# EAGLE design Soccer_V4 (EAGLE 9.6.2)
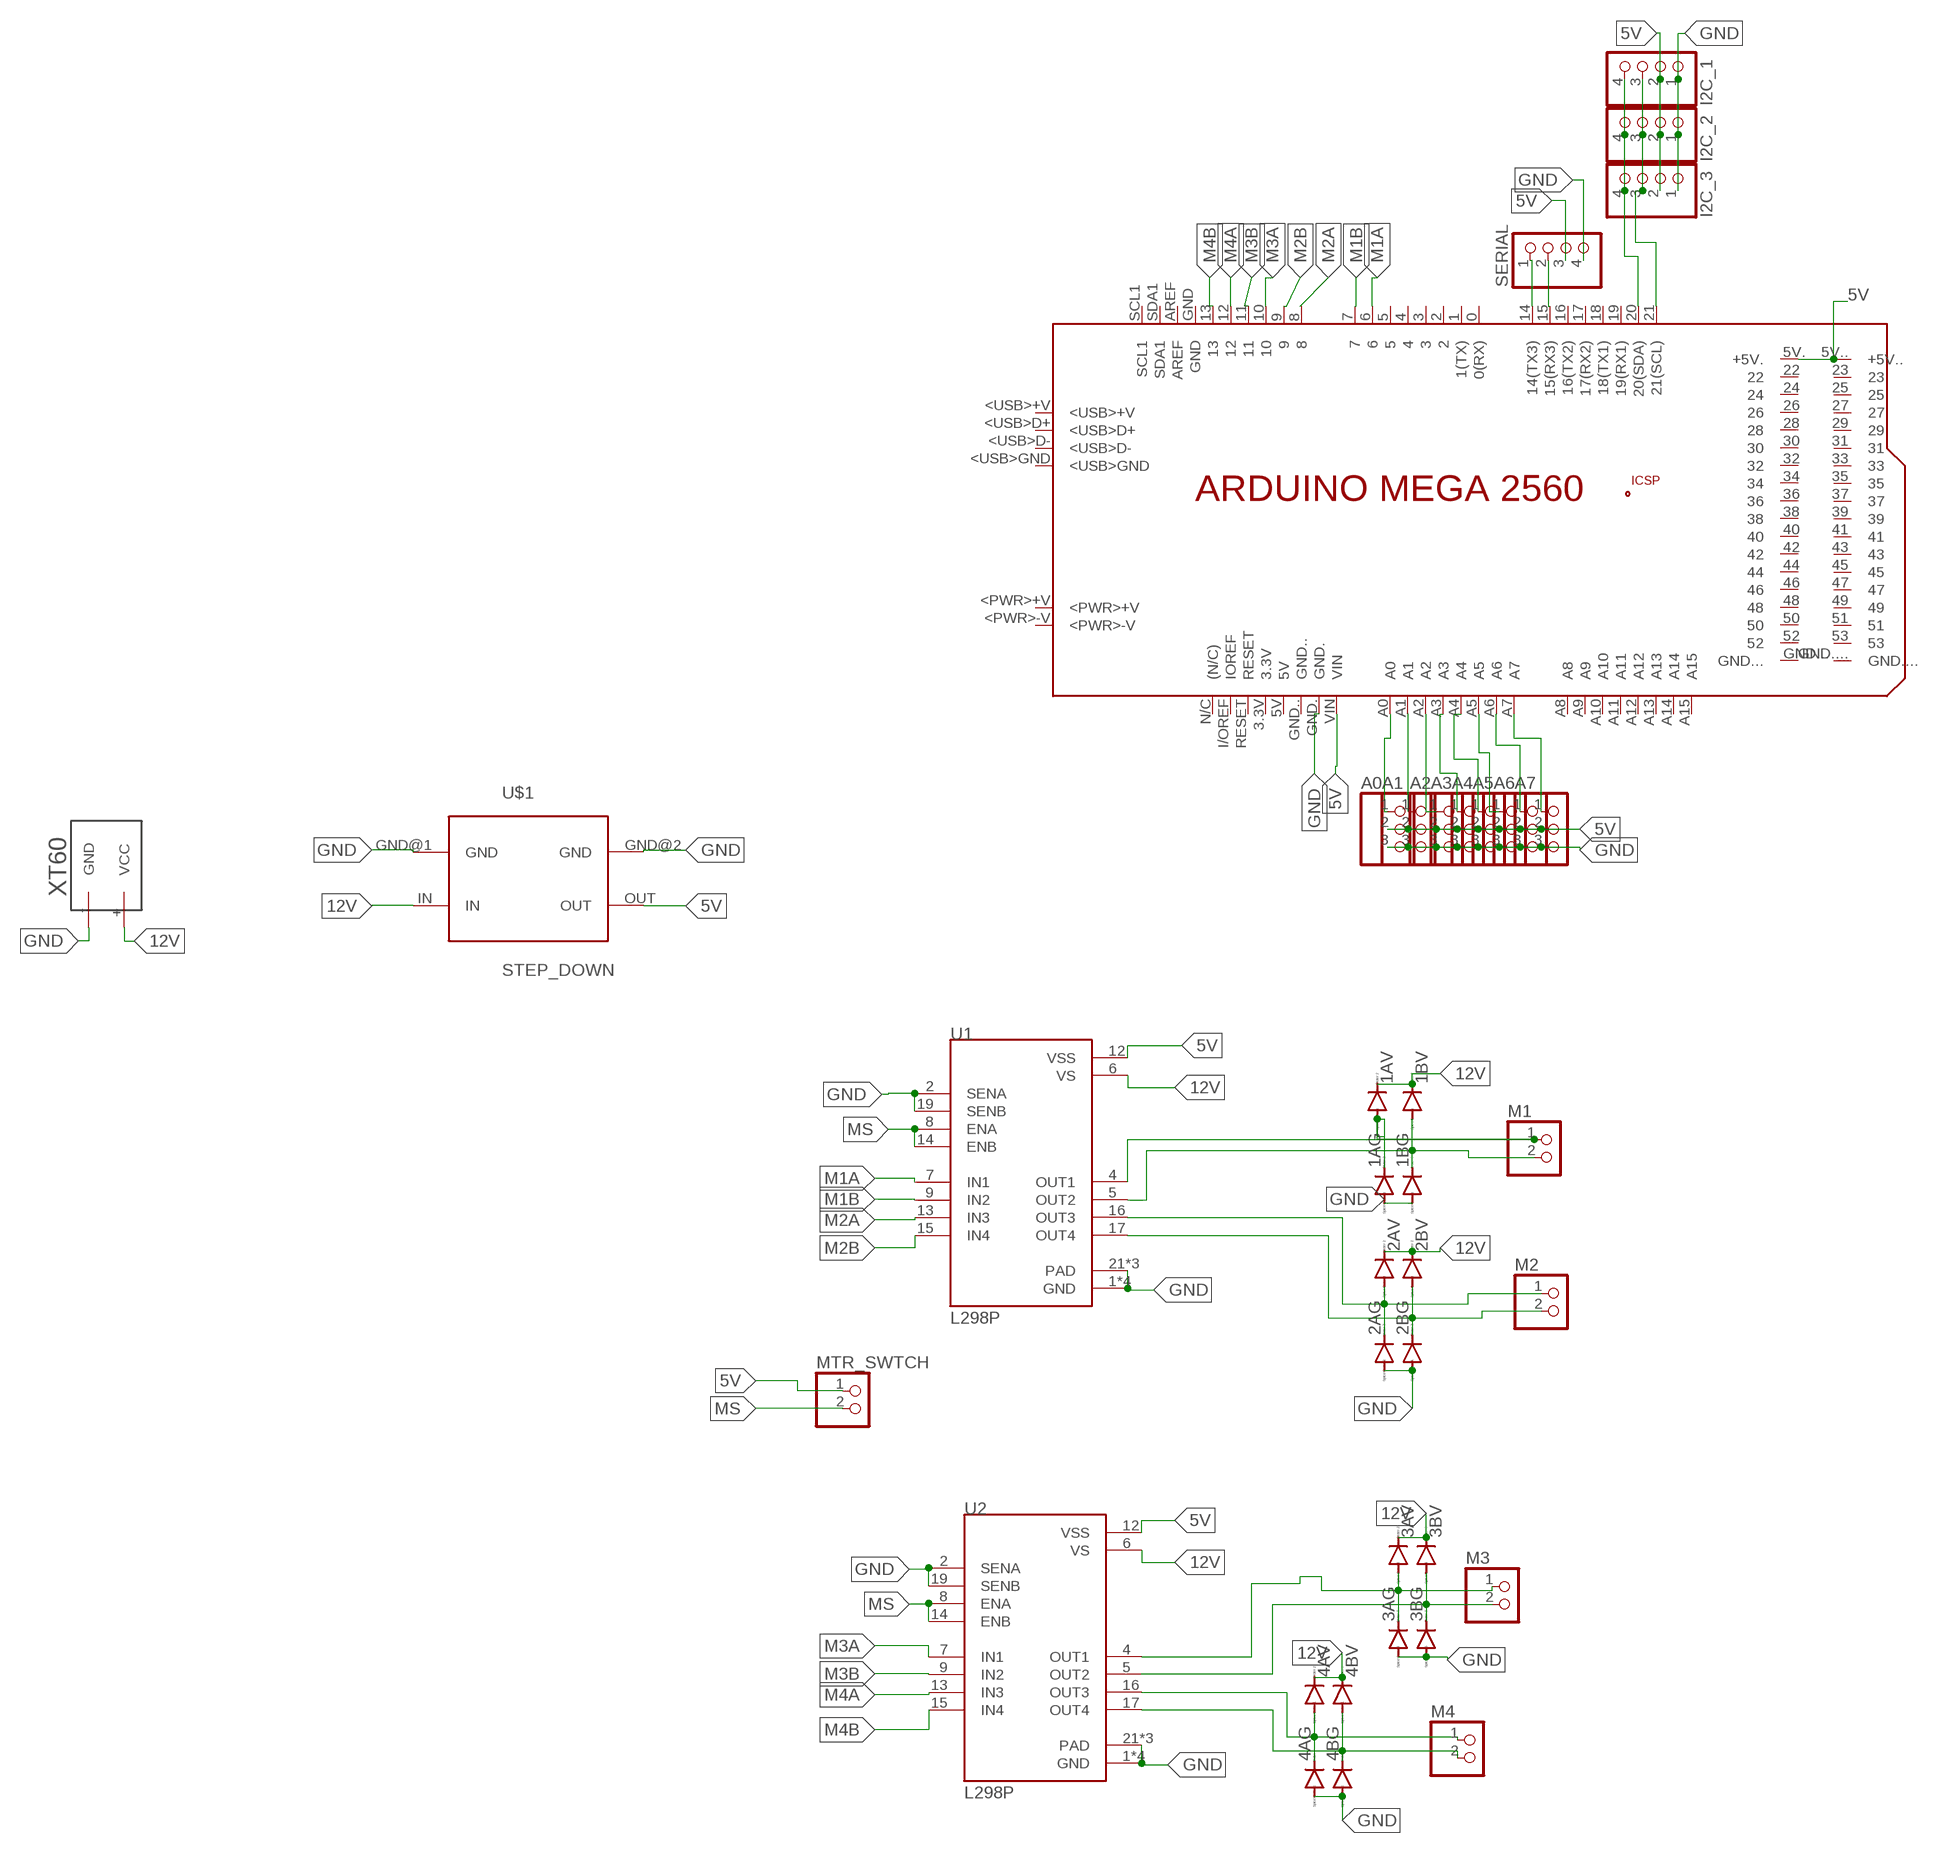
[diagram p0: schematic, sheet 1]

## Parts
1AG  1N4004  [DO41-10]
1AV  1N4004  [DO41-10]
1BG  1N4004  [DO41-10]
1BV  1N4004  [DO41-10]
2AG  1N4004  [DO41-10]
2AV  1N4004  [DO41-10]
2BG  1N4004  [DO41-10]
2BV  1N4004  [DO41-10]
3AG  1N4004  [DO41-10]
3AV  1N4004  [DO41-10]
3BG  1N4004  [DO41-10]
3BV  1N4004  [DO41-10]
4AG  1N4004  [DO41-10]
4AV  1N4004  [DO41-10]
4BG  1N4004  [DO41-10]
4BV  1N4004  [DO41-10]
A0  PINHD-1X3  [1X03]
A1  PINHD-1X3  [1X03]
A2  PINHD-1X3  [1X03]
A3  PINHD-1X3  [1X03]
A4  PINHD-1X3  [1X03]
A5  PINHD-1X3  [1X03]
A6  PINHD-1X3  [1X03]
A7  PINHD-1X3  [1X03]
I2C_1  PINHD-1X4  [1X04]
I2C_2  PINHD-1X4  [1X04]
I2C_3  PINHD-1X4  [1X04]
M1  PINHD-1X2  [1X02]
M2  PINHD-1X2  [1X02]
M3  PINHD-1X2  [1X02]
M4  PINHD-1X2  [1X02]
MTR_SWTCH  PINHD-1X2  [1X02]
PCB1  ARDUINO_MEGA2560  [ARDUINO_MEGA2560]
SERIAL  PINHD-1X4  [1X04]
U1  L298P  [SOIC127P1420X360-20N]
U2  L298P  [SOIC127P1420X360-20N]
U$1  STEP_DOWN  [STEP_DOWN_5V]
U$2  XT60  [XT60]

## Nets
5V: A0.2 A1.2 A2.2 A3.2 A4.2 A5.2 A6.2 A7.2 I2C_1.2 I2C_2.2 I2C_3.2 MTR_SWTCH.1 PCB1.5V.(+5V.) PCB1.5V..(+5V..) PCB1.VIN SERIAL.3 U1.12(VSS) U2.12(VSS) U$1.OUT
12V: 1AV.C 1BV.C 2AV.C 2BV.C 3AV.C 3BV.C 4AV.C 4BV.C U1.6(VS) U2.6(VS) U$1.IN U$2.+(VCC)
GND: 1AG.A 1BG.A 2AG.A 2BG.A 3AG.A 3BG.A 4AG.A 4BG.A A0.3 A1.3 A2.3 A3.3 A4.3 A5.3 A6.3 A7.3 I2C_1.1 I2C_2.1 I2C_3.1 PCB1.GND. SERIAL.4 U1.1(GND) U1.2(SENA) U1.10(GND) U1.11(GND) U1.19(SENB) U1.20(GND) U1.21(PAD) U1.22(PAD) U1.23(PAD) U2.1(GND) U2.2(SENA) U2.10(GND) U2.11(GND) U2.19(SENB) U2.20(GND) U2.21(PAD) U2.22(PAD) U2.23(PAD) U$1.GND@1(GND) U$1.GND@2(GND) U$2.-(GND)
M1A: PCB1.6 U1.7(IN1)
M1B: PCB1.7 U1.9(IN2)
M2A: PCB1.8 U1.13(IN3)
M2B: PCB1.9 U1.15(IN4)
M3A: PCB1.10 U2.7(IN1)
M3B: PCB1.11 U2.9(IN2)
M4A: PCB1.12 U2.13(IN3)
M4B: PCB1.13 U2.15(IN4)
MS: MTR_SWTCH.2 U1.8(ENA) U1.14(ENB) U2.8(ENA) U2.14(ENB)
N$1: A0.1 PCB1.A0
N$2: A1.1 PCB1.A1
N$3: A2.1 PCB1.A2
N$4: A3.1 PCB1.A3
N$5: A4.1 PCB1.A4
N$6: A5.1 PCB1.A5
N$7: A6.1 PCB1.A6
N$8: A7.1 PCB1.A7
N$9: PCB1.14(14(TX3)) SERIAL.1
N$10: PCB1.15(15(RX3)) SERIAL.2
N$11: I2C_1.4 I2C_2.4 I2C_3.4 PCB1.20(20(SDA))
N$12: I2C_1.3 I2C_2.3 I2C_3.3 PCB1.21(21(SCL))
N$21: 1AG.C 1AV.A M1.1 U1.4(OUT1)
N$22: 1BG.C 1BV.A M1.2 U1.5(OUT2)
N$23: 2AG.C 2AV.A M2.1 U1.16(OUT3)
N$24: 2BG.C 2BV.A M2.2 U1.17(OUT4)
N$25: 3AG.C 3AV.A M3.1 U2.4(OUT1)
N$26: 3BG.C 3BV.A M3.2 U2.5(OUT2)
N$27: 4AG.C 4AV.A M4.1 U2.16(OUT3)
N$28: 4BG.C 4BV.A M4.2 U2.17(OUT4)
Unconnected: PCB1.0(0(RX)) PCB1.1(1(TX)) PCB1.2 PCB1.3 PCB1.3.3V PCB1.4 PCB1.5 PCB1.5V PCB1.16(16(TX2)) PCB1.17(17(RX2)) PCB1.18(18(TX1)) PCB1.19(19(RX1)) PCB1.22 PCB1.23 PCB1.24 PCB1.25 PCB1.26 PCB1.27 PCB1.28 PCB1.29 PCB1.30 PCB1.31 PCB1.32 PCB1.33 PCB1.34 PCB1.35 PCB1.36 PCB1.37 PCB1.38 PCB1.39 PCB1.40 PCB1.41 PCB1.42 PCB1.43 PCB1.44 PCB1.45 PCB1.46 PCB1.47 PCB1.48 PCB1.49 PCB1.50 PCB1.51 PCB1.52 PCB1.53 PCB1.+5V_ PCB1.<PWR>+V PCB1.<PWR>-V PCB1.<USB>+V PCB1.<USB>D+ PCB1.<USB>D- PCB1.<USB>GND PCB1.A8 PCB1.A9 PCB1.A10 PCB1.A11 PCB1.A12 PCB1.A13 PCB1.A14 PCB1.A15 PCB1.AREF PCB1.GND PCB1.GND.. PCB1.GND... PCB1.GND.... PCB1.GND__ PCB1.I/OREF(IOREF) PCB1.MISO PCB1.MOSI PCB1.N/C((N/C)) PCB1.RESET PCB1.RESET. PCB1.SCK PCB1.SCL1 PCB1.SDA1

## Library data of the parts
1AG 1AV 1BG 1BV 2AG 2AV 2BG 2BV 3AG 3AV 3BG 3BV 4AG 4AV 4BG 4BV = diode:1N4004: DIODE general purpose rectifier, 1 A
A0 A1-A7 = pinhead:PINHD-1X3: PIN HEADER
I2C_1-I2C_3 SERIAL = pinhead:PINHD-1X4: PIN HEADER
M1-M4 MTR_SWTCH = pinhead:PINHD-1X2: PIN HEADER
PCB1 = !Arduino:ARDUINO_MEGA2560: Device for representing an Arduino Mega 2560 board with a footprint in an EAGLE design. Created by Dave Young for Element14. More EAGLE documentation at: http://www.element14.com/community/community/knode/cadsoft_eagle
U1 U2 = !L298P:L298P: L298 Series Dual Full Bridge 4 A 46 V Driver Surface Mount - PowerSO-20 Check availability <https://pricing.snapeda.com/parts/L298P/STMicroelectronics/view-part?ref=eda>; AVAILABILITY: In Stock; DESCRIPTION: Half Bridge (4) Driver DC Motors, Relays, Solenoids, Stepper Motors Bipolar PowerSO-20; MF: STMicroelectronics; MP: L298P; PACKAGE: SO-20 STMicroelectronics; PRICE: None; PURCHASE-URL: https://pricing.snapeda.com/search/part/L298P/?ref=eda
U$1 = ! Custom Parts:STEP_DOWN
U$2 = ! xt60:XT60: XT60

## Board
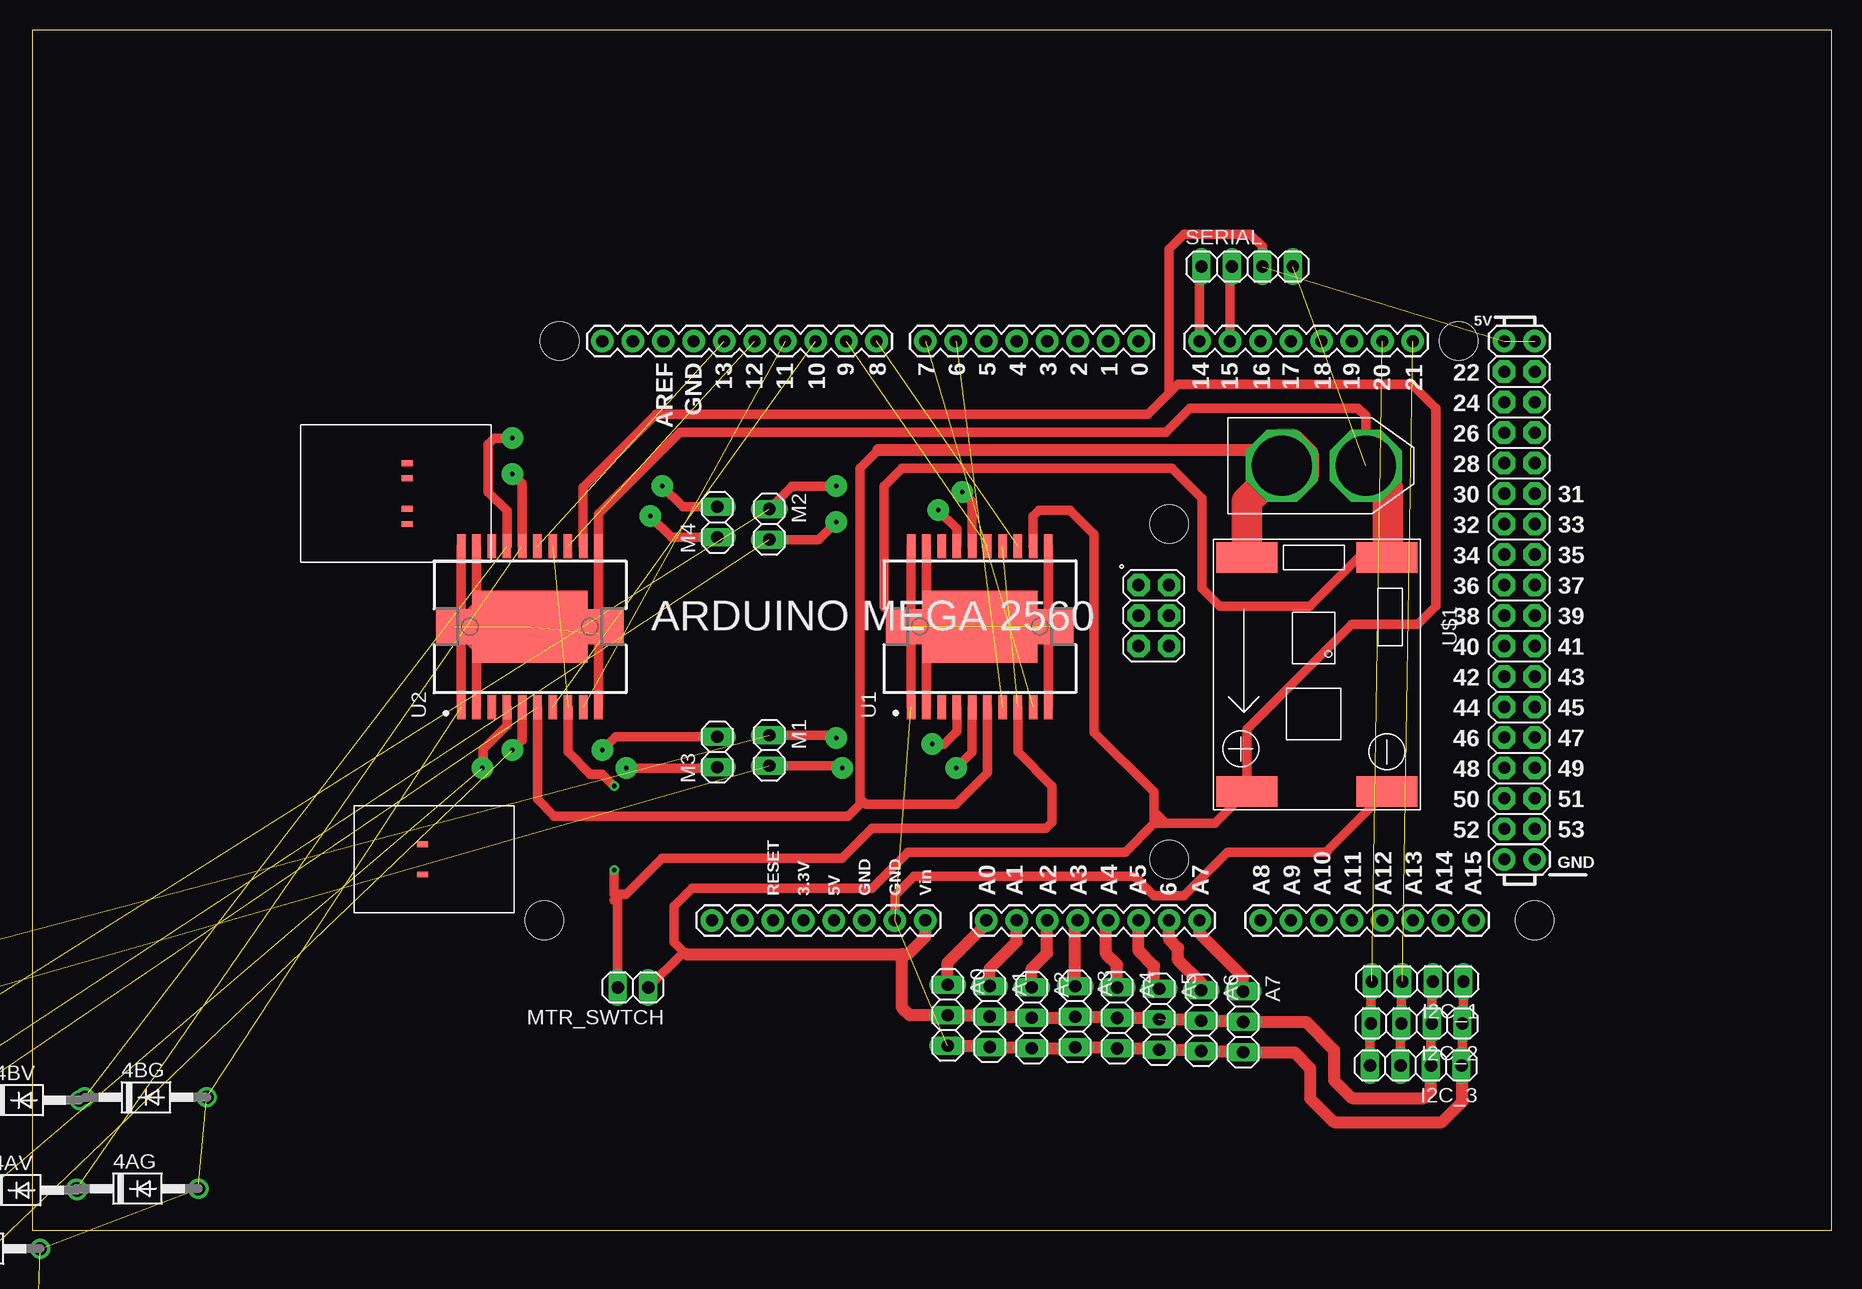
[diagram p1: board, top side]
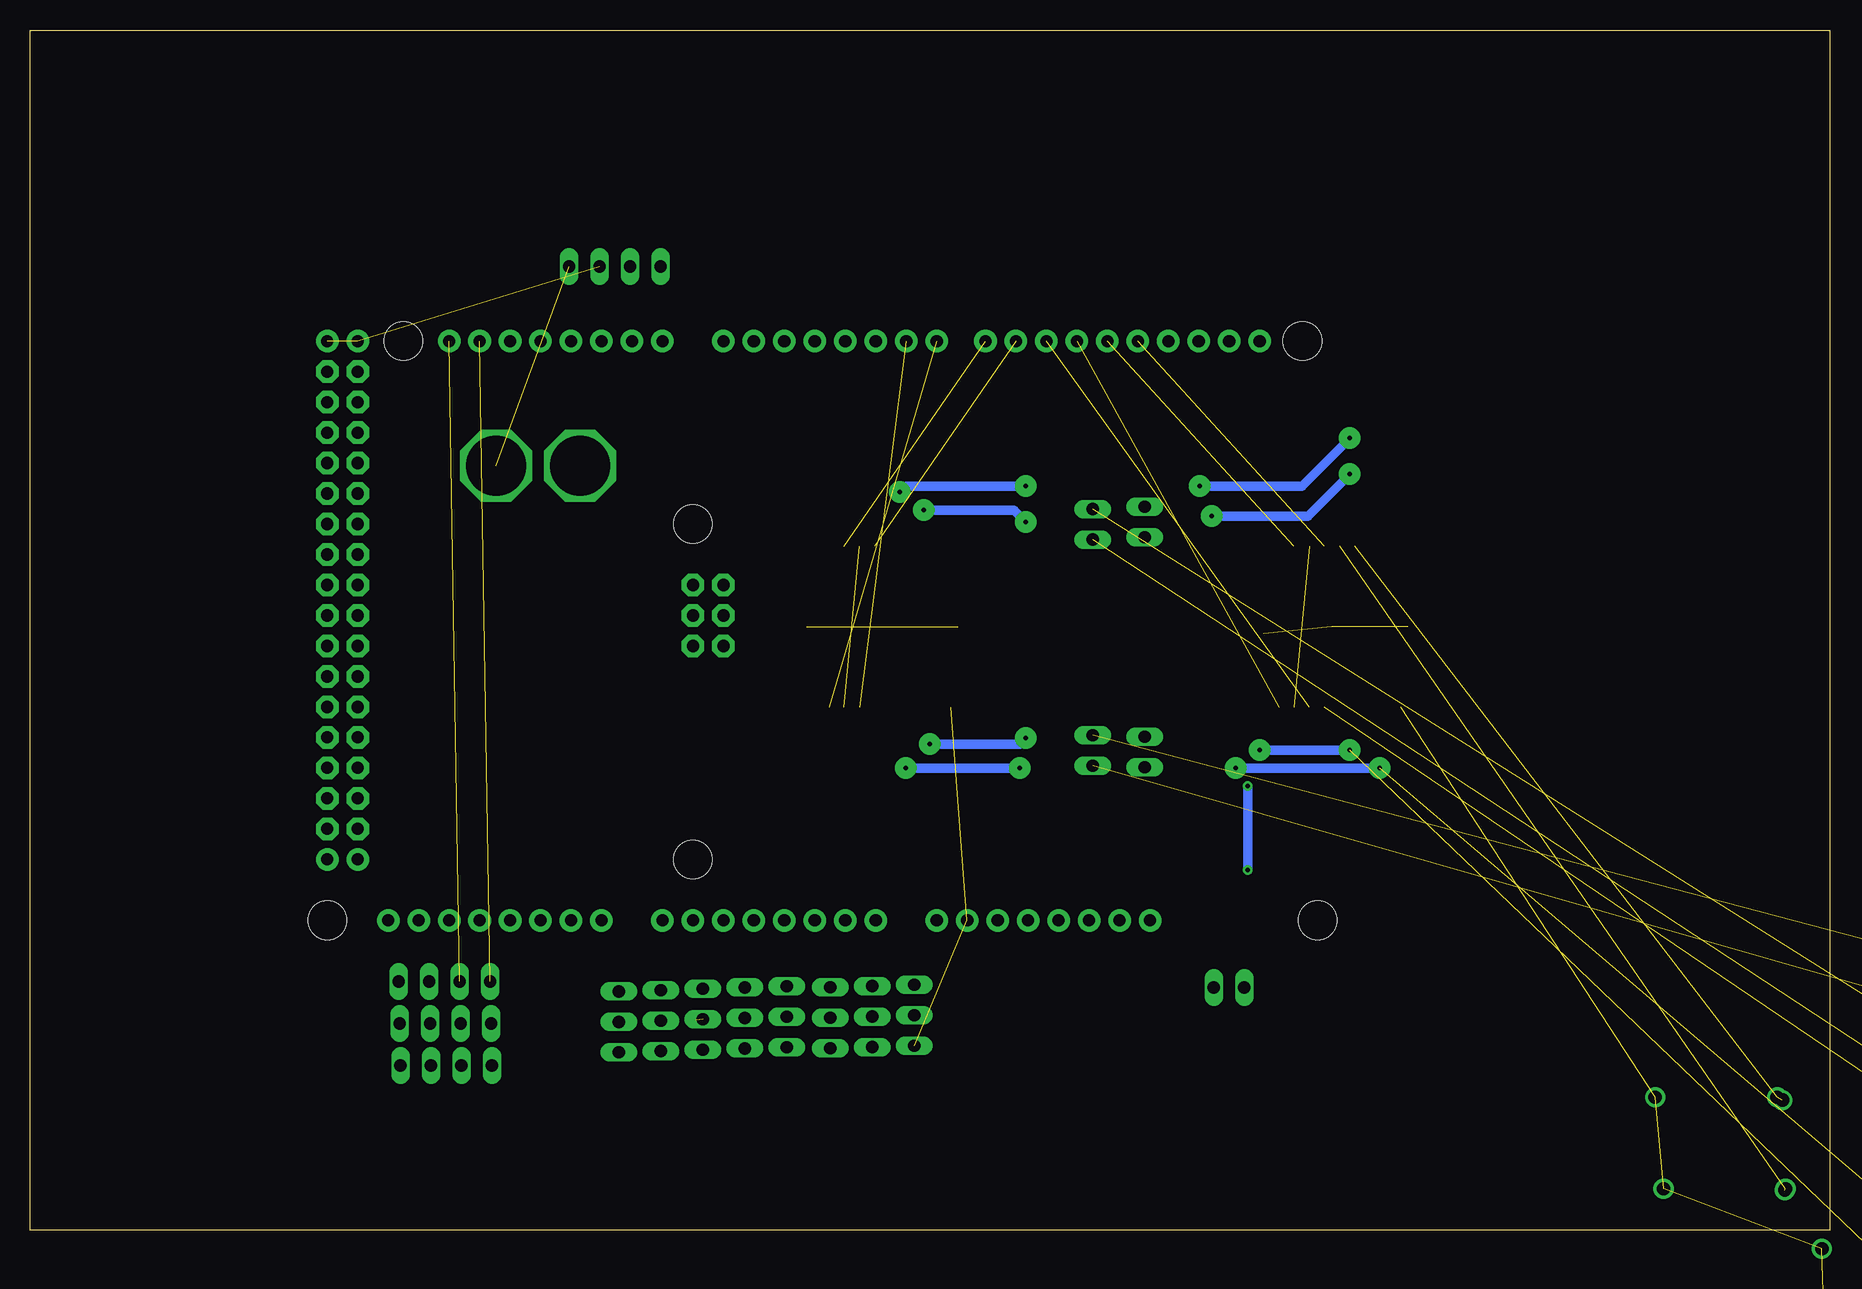
[diagram p2: board, bottom side, seen from below]

Size 150 x 100 mm. Coordinates in mm from the lower left corner, seen from the top.
Outline: 0,0 150,0 150,100 0,100 0,0
Copper layers (1*16): Top 0.035mm / dielectric 1.5mm / Bottom 0.035mm
Design rules "default": minimum track width 6mil, minimum drill 0.35mm, track to track 6mil, track to pad 6mil, pad to pad 6mil, via to via 6mil, smd to smd 6mil, copper to edge 40mil, drill to drill 6mil, minimum pad ring 10mil, minimum via ring 8mil, stop-mask expansion 4mil, vias tented up to drill 0mil, thermal gap 10mil

### Footprints (pad centres in the part's own frame; a part is rotated, then mirrored left to right if it is on the bottom)
DO41-10 = drill 1.118: A 5.08,0; C -5.08,0
1X03 = drill 1.016 long: 1 -2.54,0; 2 0,0; 3 2.54,0
1X04 = drill 1.016 long: 1 -3.81,0; 2 -1.27,0; 3 1.27,0; 4 3.81,0
1X02 = drill 1.016 long: 1 -1.27,0; 2 1.27,0
ARDUINO_MEGA2560 = drill 1.016 pad 1.88: 0 63.5,50.8; 1 60.96,50.8; 2 58.42,50.8; 3 55.88,50.8; 3.3V 35.56,2.54; 4 53.34,50.8; 5 50.8,50.8; 5V 38.1,2.54; 5V. 93.98,50.8; 5V.. 96.52,50.8; 6 48.26,50.8; 7 45.72,50.8; 8 41.656,50.8; 9 39.116,50.8; 10 36.576,50.8; 11 34.036,50.8; 12 31.496,50.8; 13 28.956,50.8; 14 68.58,50.8; 15 71.12,50.8; 16 73.66,50.8; 17 76.2,50.8; 18 78.74,50.8; 19 81.28,50.8; 20 83.82,50.8; 21 86.36,50.8; A0 50.8,2.54; A1 53.34,2.54; A2 55.88,2.54; A3 58.42,2.54; A4 60.96,2.54; A5 63.5,2.54; A6 66.04,2.54; A7 68.58,2.54; A8 73.66,2.54; A9 76.2,2.54; A10 78.74,2.54; A11 81.28,2.54; A12 83.82,2.54; A13 86.36,2.54; A14 88.9,2.54; A15 91.44,2.54; AREF 23.876,50.8; GND 26.416,50.8; GND. 43.18,2.54; GND.. 40.64,2.54; GND... 93.98,7.62; GND.... 96.52,7.62; I/OREF 30.48,2.54; N/C 27.94,2.54; RESET 33.02,2.54; SCL1 18.796,50.8; SDA1 21.336,50.8; VIN 45.72,2.54 | drill 1.016 pad 1.88 octagon: 22 93.98,48.26; 23 96.52,48.26; 24 93.98,45.72; 25 96.52,45.72; 26 93.98,43.18; 27 96.52,43.18; 28 93.98,40.64; 29 96.52,40.64; 30 93.98,38.1; 31 96.52,38.1; 32 93.98,35.56; 33 96.52,35.56; 34 93.98,33.02; 35 96.52,33.02; 36 93.98,30.48; 37 96.52,30.48; 38 93.98,27.94; 39 96.52,27.94; 40 93.98,25.4; 41 96.52,25.4; 42 93.98,22.86; 43 96.52,22.86; 44 93.98,20.32; 45 96.52,20.32; 46 93.98,17.78; 47 96.52,17.78; 48 93.98,15.24; 49 96.52,15.24; 50 93.98,12.7; 51 96.52,12.7; 52 93.98,10.16; 53 96.52,10.16; +5V_ 66.04,30.48; GND__ 66.04,25.4; MISO 63.5,30.48; MOSI 66.04,27.94; RESET. 63.5,25.4; SCK 63.5,27.94 | smd 1.016 x 0.508: <PWR>+V 3.81,8.89; <PWR>-V 3.81,6.35; <USB>+V 2.54,40.64; <USB>D+ 2.54,39.37; <USB>D- 2.54,36.83; <USB>GND 2.54,35.56 | hole 3.2: 15.24,50.8; 13.97,2.54; 66.04,35.56; 66.04,7.62; 90.17,50.8; 96.52,2.54
SOIC127P1420X360-20N = smd 2 x 0.7: 1 -6.7,5.715; 2 -6.7,4.445; 3 -6.7,3.175; 4 -6.7,1.905; 5 -6.7,0.635; 6 -6.7,-0.635; 7 -6.7,-1.905; 8 -6.7,-3.175; 9 -6.7,-4.445; 10 -6.7,-5.715; 11 6.7,-5.715; 12 6.7,-4.445; 13 6.7,-3.175; 14 6.7,-1.905; 15 6.7,-0.635; 16 6.7,0.635; 17 6.7,1.905; 18 6.7,3.175; 19 6.7,4.445; 20 6.7,5.715 | smd 6 x 9.6: 21 0,0 | smd 2.9 x 3.05: 22 0,6.3; 23 0,-6.3
STEP_DOWN_5V = smd 2.54 x 5.08: GND@1 1.524,14.47; GND@2 21.018,14.47; IN 1.524,2.794; OUT 21.018,2.794
XT60 = drill 5 octagon: + 4.5,0; - 11.5,0

### Placement (x,y rotation side)
1AG  -46.05,11.44 0 top  (outside the outline)
1AV  -56.48,11.42 0 top  (outside the outline)
1BG  -46.25,6.44 0 top  (outside the outline)
1BV  -56.55,6.32 0 top  (outside the outline)
2AG  -31.35,-1.56 0 top  (outside the outline)
2AV  -41.75,-1.68 0 top  (outside the outline)
2BG  -31.05,-6.56 0 top  (outside the outline)
2BV  -41.55,-6.68 0 top  (outside the outline)
3AG  -4.45,-1.56 0 top
3AV  -14.75,-1.68 0 top  (outside the outline)
3BG  -4.65,-7.56 0 top  (outside the outline)
3BV  -14.95,-7.68 0 top  (outside the outline)
4AG  8.75,3.44 0 top
4AV  -1.35,3.32 0 top
4BG  9.45,11.06 0 top
4BV  -1.15,10.82 0 top
A0  76.29,17.9 270 top
A1  79.79,17.79 270 top
A2  83.29,17.68 270 top
A3  86.91,17.78 270 top
A4  90.41,17.67 270 top
A5  93.91,17.56 270 top
A6  97.41,17.45 270 top
A7  100.91,17.34 270 top
I2C_1  115.45,20.71 180 top
I2C_2  115.38,17.21 180 top
I2C_3  115.31,13.71 180 top
M1  61.41,39.96 270 top
M2  61.41,58.81 270 top
M3  57.09,39.84 90 top
M4  57.09,58.99 90 top
MTR_SWTCH  50.06,20.21 180 top
PCB1  28.7,23.27 0 top
SERIAL  101.26,80.29 0 top
U1  78.96,50.28 90 top
U2  41.46,50.27 90 top
U$1  98.42,57.56 270 top
U$2  99.64,63.69 0 top

### Tracks (layer width: path | path; a pad name or v marks a point on that pad's centre or on a via)
5V  (3 unrouted)
  Top 0.8: I2C_3.2 116.58,17.14 I2C_2.2 116.65,20.64 I2C_1.2 | 94.5,33.91 98.58,33.91 U$1.OUT 101.21,41.71 110,50.5 115.5,50.5 117,52 117,68.5 115,70.5 95.5,70.5 94.75,69.75 | 94.5,33.91 93.49,33.91 | 93.49,33.91 91.08,31.5 73,31.5 70,28.5 55,28.5 53.5,27 53.5,24 54.5,23 54.12,23 MTR_SWTCH.1 | U1.12 83.41,59.5 83.91,60 86.5,60 88.5,58 88.5,41.5 93.49,36.51 93.49,34.91 | U2.12 45.91,61.91 52,68 93,68 94.75,69.75 | 93.49,33.91 93.49,34.91 | 94.5,33.91 93.49,34.91 | SERIAL.3 102.53,81.97 101.5,83 96,83 94.75,81.75 94.75,69.75
  Top 1: 94.5,17.5 94.33,17.67 A4.2 90.3,17.78 A3.2 86.81,17.68 A2.2 83.18,17.79 A1.2 79.68,17.9 A0.2 73.1,17.9 72.5,18.5 72.5,23 | A5.2 97.3,17.56 A6.2 100.8,17.45 A7.2 106.16,17.34 108.5,15 108.5,12.5 110,11 116,11 116.58,11.58 I2C_3.2 | PCB1.VIN 74.42,24.42 73,23 72.5,23 | 54.5,23 72.5,23
12V  (8 unrouted)
  Top 0.8: 70.5,65 69,63.5 69,36 | 69,36 69,35.5 68,34.5 43.5,34.5 42.09,35.91 U2.6 | 69,36 69.5,35.5 77,35.5 79.59,38.09 U1.6
  Top 1: U$2.+ 102.83,65 70.5,65
  Top 2.54: U$2.+ 102.5,62.05 102.5,62 101.21,60.71 U$1.IN | 103.19,63.69 103,63.5 102.75,63.75 102.75,64.25 104,65.5 105,65.5 106,64.5 106,63 105,62 104.64,62.36
GND  (15 unrouted)
  Top 0.8: I2C_1.1 119.26,17.28 I2C_2.1 119.19,13.78 I2C_3.1 | U$2.- 111.14,67.86 110.5,68.5 96.5,68.5 94.5,66.5 54,66.5 47.17,59.67 U2.11 47.17,50.85 | 47.17,49.69 U2.23 47.17,50.85 | U$1.GND@2 107.89,31.54 107.89,31.5 99.61,31.5 95.99,27.87 93.49,27.87 91.86,29.5 73.5,29.5 71.88,27.88 PCB1.GND. | U1.1 73.25,49.7 73.22,49.72 | 73.22,49.72 72.72,50.22 | 72.72,50.22 U1.22 71,51.94 71,62 72.5,63.5 95,63.5 97.5,61 97.5,53.5 99,52 106.5,52 110.65,56.15 113,56.15 | U1.2 74.52,49.52 75,50 73.5,50 | 73.5,50 73.22,49.72 | U1.20 73.25,50.74 72.72,50.22 | U1.19 74.52,51.02 73.5,50 | U1.11 84.67,50.87 84.77,50.77 | 84.77,50.77 U1.23 | U1.10 84.67,50.67 84.77,50.77 | U2.10 47.17,50.85 | U2.1 35.74,49.76 | U2.22 35.23,50.27 35.25,50.25 | 35.74,49.76 35.25,50.25 | U2.2 37.02,48.48 35.74,49.76 | U2.19 37.02,52.02 35.74,50.74 | U2.20 35.74,50.74 | 35.74,50.74 35.25,50.25
  Top 1: A0.3 79.68,15.36 A1.3 83.18,15.25 A2.3 86.81,15.14 A3.3 90.3,15.24 A4.3 93.8,15.13 A5.3 97.3,15.02 A6.3 100.8,14.91 A7.3 105.2,14.8 106.5,13.5 106.5,11 108.5,9 117.5,9 119.19,10.69 119.19,13.78
  Top 2.54: U$1.GND@1 113,56.15 113,61.83 U$2.- 111,63.55 111,62 110.5,62 110,62.5 110,63.5 109.5,63.5 109.5,64.5 110,65 111.5,65 112.5,64 112.5,63.5
M1A  (1 unrouted)
M1B  (1 unrouted)
M2A  (1 unrouted)
M2B  (1 unrouted)
M3A  (1 unrouted)
M3B  (1 unrouted)
M4A  (1 unrouted)
M4B  (1 unrouted)
MS  (via drill 0.35)  (2 unrouted)
  Top 0.8: U1.8 82.14,39.87 85,37 85,34 84.5,33.5 70,33.5 67.5,31 52.5,31 49.5,28 49,28 | U2.8 44.63,39.87 46.5,38 47.5,38 v48.5,37 | v48.5,30 48.5,28 49,28 | 48.79,27.79 48.5,27.5 | 49,28 48.79,27.79 | 48.79,27.79 MTR_SWTCH.2
  Bottom 0.8: v48.5,37 v48.5,30
N$1
  Top 1: A0.1 76.29,22.29 79.5,25.5 PCB1.A0
N$2
  Top 1: A1.1 79.79,21.79 82.04,24.04 PCB1.A1
N$3
  Top 1: A2.1 83.29,21.79 84.58,23.08 PCB1.A2
N$4
  Top 1: A3.1 86.91,25.6 PCB1.A3
N$5
  Top 1: A4.1 90.41,22.09 89.5,23 89.5,25.65 PCB1.A4
N$6
  Top 1: A5.1 93.5,20.51 93.5,22 92.2,23.3 PCB1.A5
N$7
  Top 1: A6.1 97.41,20.59 95.5,22.5 95.5,23.5 94.74,24.26 PCB1.A6
N$8
  Top 1: A7.1 100.91,21.09 97.28,24.72 PCB1.A7
N$9
  Top 0.8: PCB1.14 97.28,80.12 SERIAL.1
N$10
  Top 0.8: PCB1.15 99.82,80.12 SERIAL.2
N$11  (1 unrouted)
  Top 0.8: I2C_3.4 111.5,17.14 I2C_2.4 111.57,20.64 I2C_1.4
N$12  (1 unrouted)
  Top 0.8: I2C_3.3 114.04,17.14 I2C_2.3 114.11,20.64 I2C_1.3
N$21  (via drill 0.35, 0.35 pad 1.6, 0.35 pad 1.8)  (2 unrouted)
  Top 0.8: M1.1 66.77,41.23 v67,41 | v75,40.5 75.97,40.5 77.06,41.58 U1.4
  Bottom 0.8: v75,40.5 67.5,40.5 v67,41
N$22  (via drill 0.35, 0.35 pad 1.6, 0.35 pad 1.8)  (2 unrouted)
  Top 0.8: M1.2 67.31,38.69 v67.5,38.5 | v77,38.5 78.33,39.83 U1.5
  Bottom 0.8: v67.5,38.5 v77,38.5
N$23  (via drill 0.35 pad 1.8)  (2 unrouted)
  Top 0.8: M2.1 63.33,62 v67,62 | v77.5,61.5 78.33,60.67 U1.16
  Bottom 0.8: v67,62 77,62 v77.5,61.5
N$24  (via drill 0.35 pad 1.8)  (2 unrouted)
  Top 0.8: M2.2 65.54,57.54 v67,59 | v75.5,60 77.06,58.45 U1.17
  Bottom 0.8: v67,59 68,60 v75.5,60
N$25  (via drill 0.35, 0.35 pad 1.3, 0.35 pad 1.6, 0.35 pad 1.8)  (2 unrouted)
  Top 0.8: M3.1 57.02,38.5 v49.5,38.5 | U2.4 39.55,42.07 37.55,40.07 37.55,38.55 v37.5,38.5
  Bottom 0.8: v49.5,38.5 v37.5,38.5
N$26  (via drill 0.35, 0.35 pad 1.3, 0.35 pad 1.6, 0.35 pad 1.8)  (2 unrouted)
  Top 0.8: M3.2 48.61,41.11 v47.5,40 | U2.5 40.83,40.83 v40,40
  Bottom 0.8: v47.5,40 v40,40
N$27  (via drill 0.35 pad 1.8)  (2 unrouted)
  Top 0.8: M4.1 53.28,57.72 v51.5,59.5 | v40,63 40.83,62.17 U2.16
  Bottom 0.8: v51.5,59.5 43.5,59.5 v40,63
N$28  (via drill 0.35 pad 1.8)  (2 unrouted)
  Top 0.8: M4.2 54.24,60.26 v52.5,62 | v40,66 38.5,66 38,65.5 38,61.5 39.55,59.95 U2.17
  Bottom 0.8: v52.5,62 44,62 v40,66